# Altium project turnRacingMain.PrjPCB
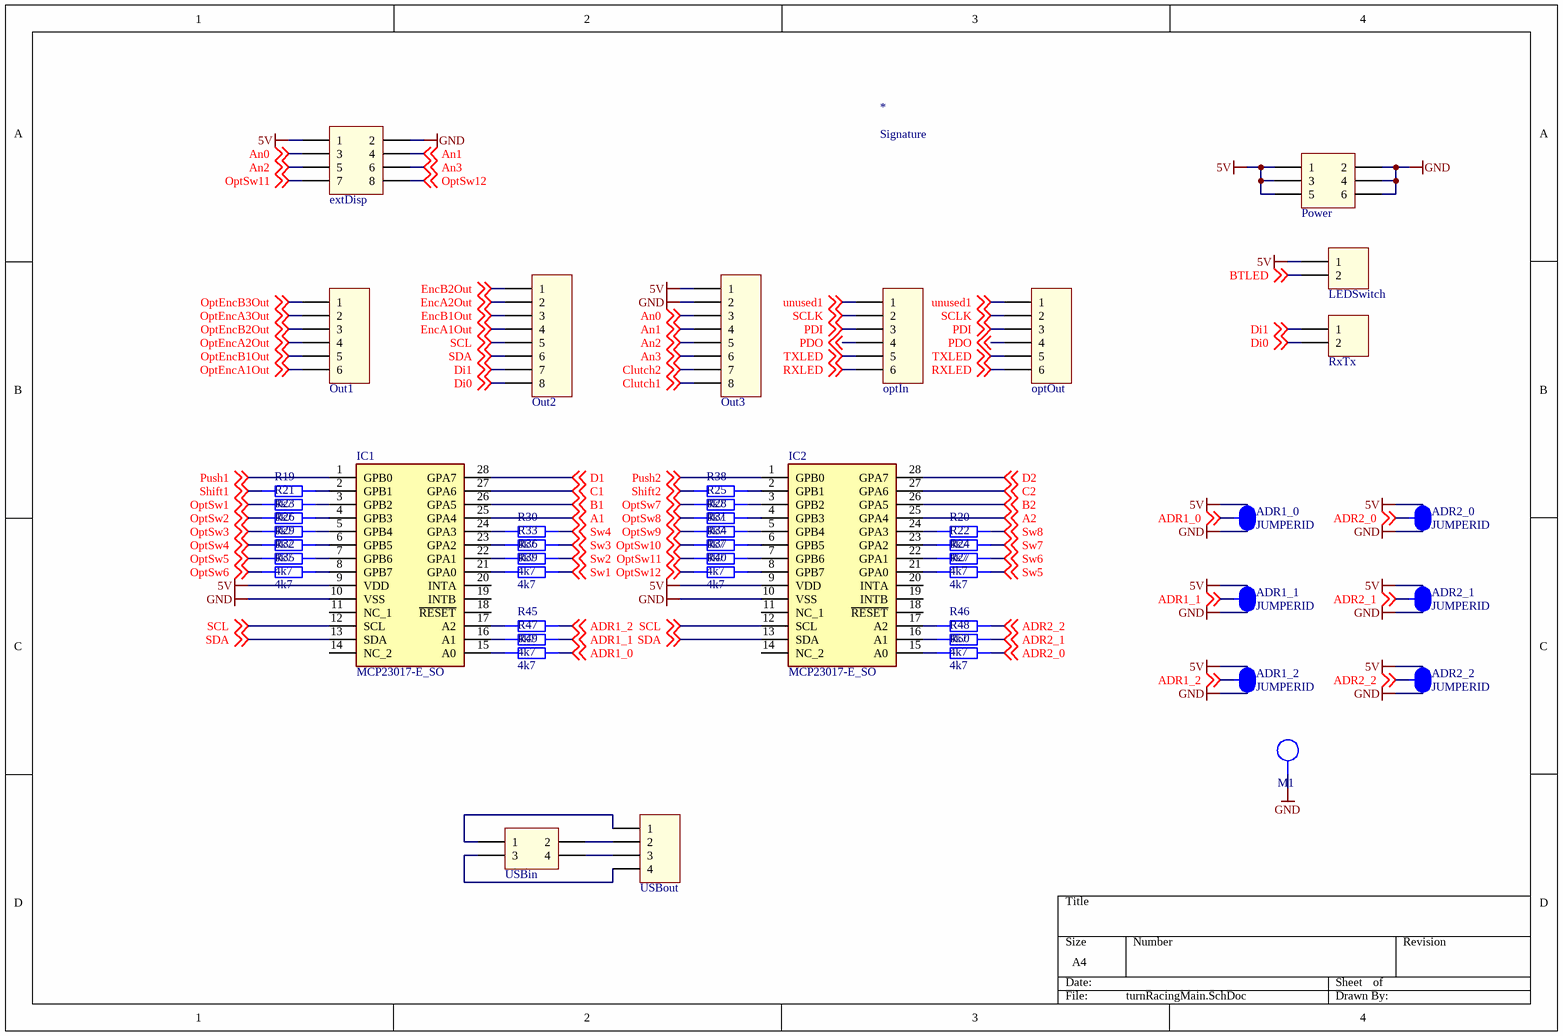
[diagram p0: turnRacingMain.SchDoc]
2 sheets, 110 parts. Net scope: global (net labels, ports and power ports of the same name join across sheets).
Board file: turnRacingMain.PcbDoc
Sheets:
  turnRacingMain.SchDoc
  turnRacingMainInput.SchDoc

## Sheet turnRacingMain.SchDoc
size A4; Rules: TODO

### Parts
*  Signature  [Signature]
ADR1_0  JUMPERID  [SMD-JUMPER-3]  (net tie, no BOM)
ADR1_1  JUMPERID  [SMD-JUMPER-3]  (net tie, no BOM)
ADR1_2  JUMPERID  [SMD-JUMPER-3]  (net tie, no BOM)
ADR2_0  JUMPERID  [SMD-JUMPER-3]  (net tie, no BOM)
ADR2_1  JUMPERID  [SMD-JUMPER-3]  (net tie, no BOM)
ADR2_2  JUMPERID  [SMD-JUMPER-3]  (net tie, no BOM)
extDisp  61300821121  [61300821121]  (value not drawn)
IC1  MCP23017-E_SO  [SOIC127P1030X265-28N]
IC2  MCP23017-E_SO  [SOIC127P1030X265-28N]
LEDSwitch  61300211121  [61300211121]  (value not drawn)
M1  mounting pad  [MOUNTING_PAD_M3]  (value not drawn)  (no BOM)
optIn  61300611121  [61300611121]  (value not drawn)
optOut  61300611121  [61300611121]  (value not drawn)
Out1  61300611121  [61300611121]  (value not drawn)
Out2  61300811121  [61300811121]  (value not drawn)
Out3  61300811121  [61300811121]  (value not drawn)
Power  61300621121  [61300621121]  (value not drawn)
R19  value 4k7  [STACKPOLE CSR0603]  (hidden comment: SMD Resistor)
R20  value 4k7  [STACKPOLE CSR0603]  (hidden comment: SMD Resistor)
R21  value 4k7  [STACKPOLE CSR0603]  (hidden comment: SMD Resistor)
R22  value 4k7  [STACKPOLE CSR0603]  (hidden comment: SMD Resistor)
R23  value 4k7  [STACKPOLE CSR0603]  (hidden comment: SMD Resistor)
R24  value 4k7  [STACKPOLE CSR0603]  (hidden comment: SMD Resistor)
R25  value 4k7  [STACKPOLE CSR0603]  (hidden comment: SMD Resistor)
R26  value 4k7  [STACKPOLE CSR0603]  (hidden comment: SMD Resistor)
R27  value 4k7  [STACKPOLE CSR0603]  (hidden comment: SMD Resistor)
R28  value 4k7  [STACKPOLE CSR0603]  (hidden comment: SMD Resistor)
R29  value 4k7  [STACKPOLE CSR0603]  (hidden comment: SMD Resistor)
R30  value 4k7  [STACKPOLE CSR0603]  (hidden comment: SMD Resistor)
R31  value 4k7  [STACKPOLE CSR0603]  (hidden comment: SMD Resistor)
R32  value 4k7  [STACKPOLE CSR0603]  (hidden comment: SMD Resistor)
R33  value 4k7  [STACKPOLE CSR0603]  (hidden comment: SMD Resistor)
R34  value 4k7  [STACKPOLE CSR0603]  (hidden comment: SMD Resistor)
R35  value 4k7  [STACKPOLE CSR0603]  (hidden comment: SMD Resistor)
R36  value 4k7  [STACKPOLE CSR0603]  (hidden comment: SMD Resistor)
R37  value 4k7  [STACKPOLE CSR0603]  (hidden comment: SMD Resistor)
R38  value 4k7  [STACKPOLE CSR0603]  (hidden comment: SMD Resistor)
R39  value 4k7  [STACKPOLE CSR0603]  (hidden comment: SMD Resistor)
R40  value 4k7  [STACKPOLE CSR0603]  (hidden comment: SMD Resistor)
R45  value 4k7  [STACKPOLE CSR0603]  (hidden comment: SMD Resistor)
R46  value 4k7  [STACKPOLE CSR0603]  (hidden comment: SMD Resistor)
R47  value 4k7  [STACKPOLE CSR0603]  (hidden comment: SMD Resistor)
R48  value 4k7  [STACKPOLE CSR0603]  (hidden comment: SMD Resistor)
R49  value 4k7  [STACKPOLE CSR0603]  (hidden comment: SMD Resistor)
R50  value 4k7  [STACKPOLE CSR0603]  (hidden comment: SMD Resistor)
RxTx  61300211121  [61300211121]  (value not drawn)
USBin  61300421121  [61300421121]  (value not drawn)
USBout  61300411121  [61300411121]  (value not drawn)

### Nets
5V: ADR1_0.3 ADR1_1.3 ADR1_2.3 ADR2_0.3 ADR2_1.3 ADR2_2.3 extDisp.1 IC1.9(VDD) IC2.9(VDD) LEDSwitch.1 Out3.1 Power.1 Power.3 Power.5
GND: ADR1_0.1 ADR1_1.1 ADR1_2.1 ADR2_0.1 ADR2_1.1 ADR2_2.1 extDisp.2 IC1.10(VSS) IC2.10(VSS) M1.1 Out3.2 Power.2 Power.4 Power.6
A1: IC1.25(GPA4) ; off-sheet A1
A2: IC2.25(GPA4) ; off-sheet A2
ADR1_0: ADR1_0.2 R49.1 ; off-sheet ADR1_0
ADR1_1: ADR1_1.2 R47.1 ; off-sheet ADR1_1
ADR1_2: ADR1_2.2 R45.1 ; off-sheet ADR1_2
ADR2_0: ADR2_0.2 R50.1 ; off-sheet ADR2_0
ADR2_1: ADR2_1.2 R48.1 ; off-sheet ADR2_1
ADR2_2: ADR2_2.2 R46.1 ; off-sheet ADR2_2
An0: extDisp.3 Out3.3 ; off-sheet An0
An1: extDisp.4 Out3.4 ; off-sheet An1
An2: extDisp.5 Out3.5 ; off-sheet An2
An3: extDisp.6 Out3.6 ; off-sheet An3
B1: IC1.26(GPA5) ; off-sheet B1
B2: IC2.26(GPA5) ; off-sheet B2
BTLED: LEDSwitch.2 ; off-sheet BTLED
C1: IC1.27(GPA6) ; off-sheet C1
C2: IC2.27(GPA6) ; off-sheet C2
Clutch1: Out3.8 ; off-sheet Clutch1
Clutch2: Out3.7 ; off-sheet Clutch2
D1: IC1.28(GPA7) ; off-sheet D1
D2: IC2.28(GPA7) ; off-sheet D2
Di0: Out2.8 RxTx.2 ; off-sheet Di0
Di1: Out2.7 RxTx.1 ; off-sheet Di1
EncA1Out: Out2.4 ; off-sheet EncA1Out  [project net EncA1]
EncA2Out: Out2.2 ; off-sheet EncA2Out  [project net EncA2]
EncB1Out: Out2.3 ; off-sheet EncB1Out  [project net EncB1]
EncB2Out: Out2.1 ; off-sheet EncB2Out  [project net EncB2]
OptEncA1Out: Out1.6 ; off-sheet OptEncA1Out  [project net OptEncA1]
OptEncA2Out: Out1.4 ; off-sheet OptEncA2Out  [project net OptEncA2]
OptEncA3Out: Out1.2 ; off-sheet OptEncA3Out  [project net OptEncA3]
OptEncB1Out: Out1.5 ; off-sheet OptEncB1Out  [project net OptEncB1]
OptEncB2Out: Out1.3 ; off-sheet OptEncB2Out  [project net OptEncB2]
OptEncB3Out: Out1.1 ; off-sheet OptEncB3Out  [project net OptEncB3]
OptSw1: R21.2 ; off-sheet OptSw1
OptSw2: R23.2 ; off-sheet OptSw2
OptSw3: R26.2 ; off-sheet OptSw3
OptSw4: R29.2 ; off-sheet OptSw4
OptSw5: R32.2 ; off-sheet OptSw5
OptSw6: R35.2 ; off-sheet OptSw6
OptSw7: R25.2 ; off-sheet OptSw7
OptSw8: R28.2 ; off-sheet OptSw8
OptSw9: R31.2 ; off-sheet OptSw9
OptSw10: R34.2 ; off-sheet OptSw10
OptSw11: extDisp.7 R37.2 ; off-sheet OptSw11
OptSw12: extDisp.8 R40.2 ; off-sheet OptSw12
PDI: optIn.3 optOut.3 ; off-sheet PDI
PDO: optIn.4 optOut.4 ; off-sheet PDO
Push1: IC1.1(GPB0) ; off-sheet Push1
Push2: IC2.1(GPB0) ; off-sheet Push2
RXLED: optIn.6 optOut.6 ; off-sheet RXLED
SCL: IC1.12(SCL) IC2.12(SCL) Out2.5 ; off-sheet SCL
SCLK: optIn.2 optOut.2 ; off-sheet SCLK
SDA: IC1.13(SDA) IC2.13(SDA) Out2.6 ; off-sheet SDA
Shift1: R19.2 ; off-sheet Shift1
Shift2: R38.2 ; off-sheet Shift2
Sw1: R39.1 ; off-sheet Sw1
Sw2: R36.1 ; off-sheet Sw2
Sw3: R33.1 ; off-sheet Sw3
Sw4: R30.1 ; off-sheet Sw4
Sw5: R27.1 ; off-sheet Sw5
Sw6: R24.1 ; off-sheet Sw6
Sw7: R22.1 ; off-sheet Sw7
Sw8: R20.1 ; off-sheet Sw8
TXLED: optIn.5 optOut.5 ; off-sheet TXLED
unused1: optIn.1 optOut.1 ; off-sheet unused1
NetIC1_2: IC1.2(GPB1) R19.1
NetIC1_3: IC1.3(GPB2) R21.1
NetIC1_4: IC1.4(GPB3) R23.1
NetIC1_5: IC1.5(GPB4) R26.1
NetIC1_6: IC1.6(GPB5) R29.1
NetIC1_7: IC1.7(GPB6) R32.1
NetIC1_8: IC1.8(GPB7) R35.1
NetIC1_15: IC1.15(A0) R49.2
NetIC1_16: IC1.16(A1) R47.2
NetIC1_17: IC1.17(A2) R45.2
NetIC1_21: IC1.21(GPA0) R39.2
NetIC1_22: IC1.22(GPA1) R36.2
NetIC1_23: IC1.23(GPA2) R33.2
NetIC1_24: IC1.24(GPA3) R30.2
NetIC2_2: IC2.2(GPB1) R38.1
NetIC2_3: IC2.3(GPB2) R25.1
NetIC2_4: IC2.4(GPB3) R28.1
NetIC2_5: IC2.5(GPB4) R31.1
NetIC2_6: IC2.6(GPB5) R34.1
NetIC2_7: IC2.7(GPB6) R37.1
NetIC2_8: IC2.8(GPB7) R40.1
NetIC2_15: IC2.15(A0) R50.2
NetIC2_16: IC2.16(A1) R48.2
NetIC2_17: IC2.17(A2) R46.2
NetIC2_21: IC2.21(GPA0) R27.2
NetIC2_22: IC2.22(GPA1) R24.2
NetIC2_23: IC2.23(GPA2) R22.2
NetIC2_24: IC2.24(GPA3) R20.2
NetUSBin_1: USBin.1 USBout.1
NetUSBin_2: USBin.2 USBout.2
NetUSBin_3: USBin.3 USBout.4
NetUSBin_4: USBin.4 USBout.3

Not connected (* = marked no-connect by the designer): IC1 11(NC_1) 14(NC_2) 18(~{RESET}) 19(INTB) 20(INTA); IC2 11(NC_1) 14(NC_2) 18(~{RESET}) 19(INTB) 20(INTA)

### Notes on the sheet
- Title:
- Projekt:
- Revision:
- Author:
- Rules:
- Checked by:
- Sheet
- of
- Size:
- A4
- Date:
- Time:

### Library data of the parts
ADR1_0-ADR1_2 ADR2_0-ADR2_2 = SMD Jumper 3
extDisp = 61300821121: WR-PHD 2.54 mm THT Dual Pin Header, 8p; Pin Number: 8; Rated Current: 3 A; Working Voltage: 250 VAC; Withstanding Voltage: 500 VAC; Pitch: 2.54 mm; ComponentLink1Description: Manufacturer; ComponentLink1URL: http://www.we-online.de; ComponentLink2Description: Datasheet; ComponentLink2URL: http://katalog.we-online.de/em/datasheet/6130xx21121.pdf; Part Number: 61300821121; Published Date: Aug 2017; Publisher: Wurth Elektronik
IC1 IC2 = MCP23017-E_SO: Integrated Circuit; Manufacturer_Name: Microchip; Manufacturer_Part_Number: MCP23017-E/SO; Height: 2.65mm
LEDSwitch RxTx = 61300211121: WR-PHD 2.54 mm THT Pin Header, 2p; Pin Number: 2; Rated Current: 3 A; Working Voltage: 250 VAC; Withstanding Voltage: 500 VAC; Pitch: 2.54 mm; ComponentLink1Description: Manufacturer; ComponentLink1URL: http://www.we-online.de; ComponentLink2Description: Datasheet; ComponentLink2URL: http://katalog.we-online.de/em/datasheet/6130xx11121.pdf; Part Number: 61300211121; Published Date: Aug 2017; Publisher: Wurth Elektronik
optIn optOut Out1 = 61300611121: WR-PHD 2.54 mm THT Pin Header, 6p; Pin Number: 6; Rated Current: 3 A; Working Voltage: 250 VAC; Withstanding Voltage: 500 VAC; Pitch: 2.54 mm; ComponentLink1Description: Manufacturer; ComponentLink1URL: http://www.we-online.de; ComponentLink2Description: Datasheet; ComponentLink2URL: http://katalog.we-online.de/em/datasheet/6130xx11121.pdf; Part Number: 61300611121; Published Date: Aug 2017; Publisher: Wurth Elektronik
Out2 Out3 = 61300811121: WR-PHD 2.54 mm THT Pin Header, 8p; Pin Number: 8; Rated Current: 3 A; Working Voltage: 250 VAC; Withstanding Voltage: 500 VAC; Pitch: 2.54 mm; ComponentLink1Description: Manufacturer; ComponentLink1URL: http://www.we-online.de; ComponentLink2Description: Datasheet; ComponentLink2URL: http://katalog.we-online.de/em/datasheet/6130xx11121.pdf; Part Number: 61300811121; Published Date: Aug 2017; Publisher: Wurth Elektronik
Power = 61300621121: WR-PHD 2.54 mm THT Dual Pin Header, 6p; Pin Number: 6; Rated Current: 3 A; Working Voltage: 250 VAC; Withstanding Voltage: 500 VAC; Pitch: 2.54 mm; ComponentLink1Description: Manufacturer; ComponentLink1URL: http://www.we-online.de; ComponentLink2Description: Datasheet; ComponentLink2URL: http://katalog.we-online.de/em/datasheet/6130xx21121.pdf; Part Number: 61300621121; Published Date: Aug 2017; Publisher: Wurth Elektronik
R19-R40 R45-R50 = SMD Resistor: Resistor with multiple footprints
USBin = 61300421121: WR-PHD 2.54 mm THT Dual Pin Header, 4p; Pin Number: 4; Rated Current: 3 A; Working Voltage: 250 VAC; Withstanding Voltage: 500 VAC; Pitch: 2.54 mm; ComponentLink1Description: Manufacturer; ComponentLink1URL: http://www.we-online.de; ComponentLink2Description: Datasheet; ComponentLink2URL: http://katalog.we-online.de/em/datasheet/6130xx21121.pdf; Part Number: 61300421121; Published Date: Aug 2017; Publisher: Wurth Elektronik
USBout = 61300411121: WR-PHD 2.54 mm THT Pin Header, 4p; Pin Number: 4; Rated Current: 3 A; Working Voltage: 250 VAC; Withstanding Voltage: 500 VAC; Pitch: 2.54 mm; ComponentLink1Description: Manufacturer; ComponentLink1URL: http://www.we-online.de; ComponentLink2Description: Datasheet; ComponentLink2URL: http://katalog.we-online.de/em/datasheet/6130xx11121.pdf; Part Number: 61300411121; Published Date: Aug 2017; Publisher: Wurth Elektronik

## Sheet turnRacingMainInput.SchDoc
size A4
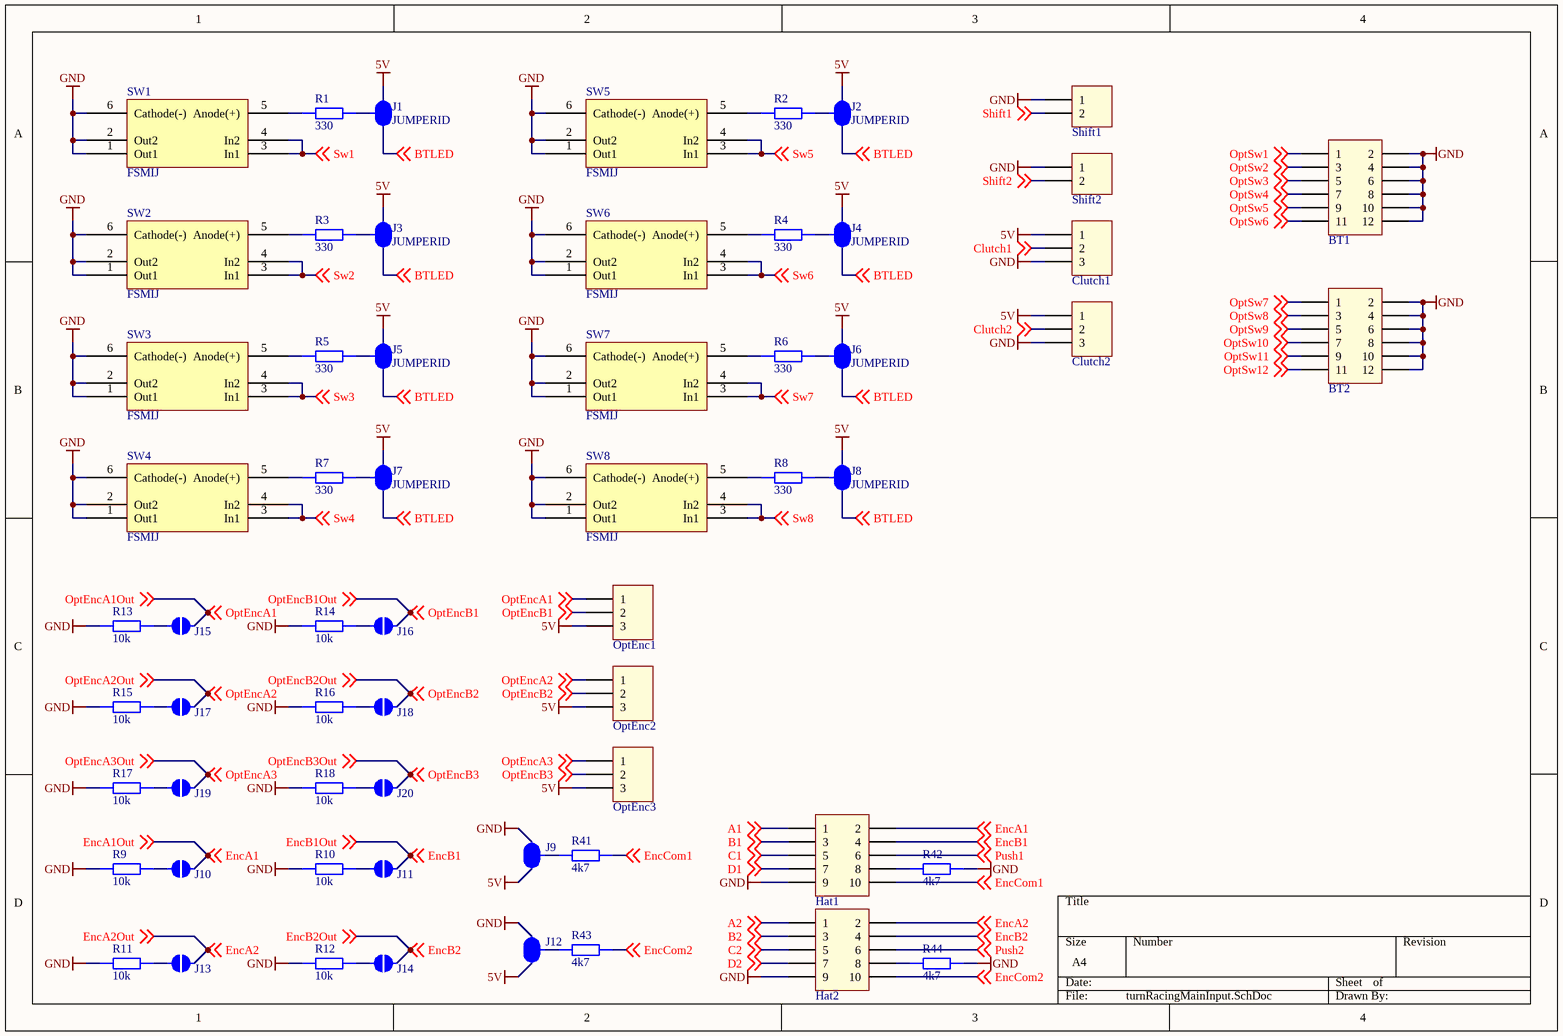
[diagram p1: turnRacingMainInput.SchDoc]

### Parts
BT1  61301221121  [61301221121]  (value not drawn)
BT2  61301221121  [61301221121]  (value not drawn)
Clutch1  61300311121  [61300311121]  (value not drawn)
Clutch2  61300311121  [61300311121]  (value not drawn)
Hat1  61301021121  [61301021121]  (value not drawn)
Hat2  61301021121  [61301021121]  (value not drawn)
J1  JUMPERID  [SMD-JUMPER-3]  (net tie, no BOM)
J2  JUMPERID  [SMD-JUMPER-3]  (net tie, no BOM)
J3  JUMPERID  [SMD-JUMPER-3]  (net tie, no BOM)
J4  JUMPERID  [SMD-JUMPER-3]  (net tie, no BOM)
J5  JUMPERID  [SMD-JUMPER-3]  (net tie, no BOM)
J6  JUMPERID  [SMD-JUMPER-3]  (net tie, no BOM)
J7  JUMPERID  [SMD-JUMPER-3]  (net tie, no BOM)
J8  JUMPERID  [SMD-JUMPER-3]  (net tie, no BOM)
J9  JUMPERID  [SMD-JUMPER-3]  (value not drawn)  (net tie, no BOM)
J10  SMD Jumper open  [SMD-JUMPER-OPEN]  (value not drawn)  (no BOM)
J11  SMD Jumper open  [SMD-JUMPER-OPEN]  (value not drawn)  (no BOM)
J12  JUMPERID  [SMD-JUMPER-3]  (value not drawn)  (net tie, no BOM)
J13  SMD Jumper open  [SMD-JUMPER-OPEN]  (value not drawn)  (no BOM)
J14  SMD Jumper open  [SMD-JUMPER-OPEN]  (value not drawn)  (no BOM)
J15  SMD Jumper open  [SMD-JUMPER-OPEN]  (value not drawn)  (no BOM)
J16  SMD Jumper open  [SMD-JUMPER-OPEN]  (value not drawn)  (no BOM)
J17  SMD Jumper open  [SMD-JUMPER-OPEN]  (value not drawn)  (no BOM)
J18  SMD Jumper open  [SMD-JUMPER-OPEN]  (value not drawn)  (no BOM)
J19  SMD Jumper open  [SMD-JUMPER-OPEN]  (value not drawn)  (no BOM)
J20  SMD Jumper open  [SMD-JUMPER-OPEN]  (value not drawn)  (no BOM)
OptEnc1  61300311121  [61300311121]  (value not drawn)
OptEnc2  61300311121  [61300311121]  (value not drawn)
OptEnc3  61300311121  [61300311121]  (value not drawn)
R1  value 330  [STACKPOLE CSR0603]  (hidden comment: SMD Resistor)
R2  value 330  [STACKPOLE CSR0603]  (hidden comment: SMD Resistor)
R3  value 330  [STACKPOLE CSR0603]  (hidden comment: SMD Resistor)
R4  value 330  [STACKPOLE CSR0603]  (hidden comment: SMD Resistor)
R5  value 330  [STACKPOLE CSR0603]  (hidden comment: SMD Resistor)
R6  value 330  [STACKPOLE CSR0603]  (hidden comment: SMD Resistor)
R7  value 330  [STACKPOLE CSR0603]  (hidden comment: SMD Resistor)
R8  value 330  [STACKPOLE CSR0603]  (hidden comment: SMD Resistor)
R9  value 10k  [STACKPOLE CSR0603]  (hidden comment: SMD Resistor)
R10  value 10k  [STACKPOLE CSR0603]  (hidden comment: SMD Resistor)
R11  value 10k  [STACKPOLE CSR0603]  (hidden comment: SMD Resistor)
R12  value 10k  [STACKPOLE CSR0603]  (hidden comment: SMD Resistor)
R13  value 10k  [STACKPOLE CSR0603]  (hidden comment: SMD Resistor)
R14  value 10k  [STACKPOLE CSR0603]  (hidden comment: SMD Resistor)
R15  value 10k  [STACKPOLE CSR0603]  (hidden comment: SMD Resistor)
R16  value 10k  [STACKPOLE CSR0603]  (hidden comment: SMD Resistor)
R17  value 10k  [STACKPOLE CSR0603]  (hidden comment: SMD Resistor)
R18  value 10k  [STACKPOLE CSR0603]  (hidden comment: SMD Resistor)
R41  value 4k7  [STACKPOLE CSR0603]  (hidden comment: SMD Resistor)
R42  value 4k7  [STACKPOLE CSR0603]  (hidden comment: SMD Resistor)
R43  value 4k7  [STACKPOLE CSR0603]  (hidden comment: SMD Resistor)
R44  value 4k7  [STACKPOLE CSR0603]  (hidden comment: SMD Resistor)
Shift1  61300211121  [61300211121]  (value not drawn)
Shift2  61300211121  [61300211121]  (value not drawn)
SW1  FSMIJ  [FSMIJ]
SW2  FSMIJ  [FSMIJ]
SW3  FSMIJ  [FSMIJ]
SW4  FSMIJ  [FSMIJ]
SW5  FSMIJ  [FSMIJ]
SW6  FSMIJ  [FSMIJ]
SW7  FSMIJ  [FSMIJ]
SW8  FSMIJ  [FSMIJ]

### Nets
5V: Clutch1.1 Clutch2.1 J1.3 J2.3 J3.3 J4.3 J5.3 J6.3 J7.3 J8.3 J9.3 J12.3 OptEnc1.3 OptEnc2.3 OptEnc3.3
GND: BT1.2 BT1.4 BT1.6 BT1.8 BT1.10 BT1.12 BT2.2 BT2.4 BT2.6 BT2.8 BT2.10 BT2.12 Clutch1.3 Clutch2.3 Hat1.9 Hat2.9 J9.1 J12.1 R9.2 R10.2 R11.2 R12.2 R13.2 R14.2 R15.2 R16.2 R17.2 R18.2 R42.1 R44.1 Shift1.1 Shift2.1 SW1.1(Out1) SW1.2(Out2) SW1.6(Cathode(-)) SW2.1(Out1) SW2.2(Out2) SW2.6(Cathode(-)) SW3.1(Out1) SW3.2(Out2) SW3.6(Cathode(-)) SW4.1(Out1) SW4.2(Out2) SW4.6(Cathode(-)) SW5.1(Out1) SW5.2(Out2) SW5.6(Cathode(-)) SW6.1(Out1) SW6.2(Out2) SW6.6(Cathode(-)) SW7.1(Out1) SW7.2(Out2) SW7.6(Cathode(-)) SW8.1(Out1) SW8.2(Out2) SW8.6(Cathode(-))
A1: Hat1.1 ; off-sheet A1
A2: Hat2.1 ; off-sheet A2
B1: Hat1.3 ; off-sheet B1
B2: Hat2.3 ; off-sheet B2
BTLED: J1.1 J2.1 J3.1 J4.1 J5.1 J6.1 J7.1 J8.1 ; off-sheet BTLED
C1: Hat1.5 ; off-sheet C1
C2: Hat2.5 ; off-sheet C2
Clutch1: Clutch1.2 ; off-sheet Clutch1
Clutch2: Clutch2.2 ; off-sheet Clutch2
D1: Hat1.7 ; off-sheet D1
D2: Hat2.7 ; off-sheet D2
EncA1: Hat1.2 J10.1 ; off-sheet EncA1, off-sheet EncA1Out  [also labelled EncA1Out]
EncA2: Hat2.2 J13.1 ; off-sheet EncA2, off-sheet EncA2Out  [also labelled EncA2Out]
EncB1: Hat1.4 J11.1 ; off-sheet EncB1, off-sheet EncB1Out  [also labelled EncB1Out]
EncB2: Hat2.4 J14.1 ; off-sheet EncB2, off-sheet EncB2Out  [also labelled EncB2Out]
EncCom1: Hat1.10 R41.1 ; off-sheet EncCom1
EncCom2: Hat2.10 R43.1 ; off-sheet EncCom2
OptEncA1: J15.1 OptEnc1.1 ; off-sheet OptEncA1Out, off-sheet OptEncA1  [also labelled OptEncA1Out]
OptEncA2: J17.1 OptEnc2.1 ; off-sheet OptEncA2Out, off-sheet OptEncA2  [also labelled OptEncA2Out]
OptEncA3: J19.1 OptEnc3.1 ; off-sheet OptEncA3Out, off-sheet OptEncA3  [also labelled OptEncA3Out]
OptEncB1: J16.1 OptEnc1.2 ; off-sheet OptEncB1Out, off-sheet OptEncB1  [also labelled OptEncB1Out]
OptEncB2: J18.1 OptEnc2.2 ; off-sheet OptEncB2Out, off-sheet OptEncB2  [also labelled OptEncB2Out]
OptEncB3: J20.1 OptEnc3.2 ; off-sheet OptEncB3Out, off-sheet OptEncB3  [also labelled OptEncB3Out]
OptSw1: BT1.1 ; off-sheet OptSw1
OptSw2: BT1.3 ; off-sheet OptSw2
OptSw3: BT1.5 ; off-sheet OptSw3
OptSw4: BT1.7 ; off-sheet OptSw4
OptSw5: BT1.9 ; off-sheet OptSw5
OptSw6: BT1.11 ; off-sheet OptSw6
OptSw7: BT2.1 ; off-sheet OptSw7
OptSw8: BT2.3 ; off-sheet OptSw8
OptSw9: BT2.5 ; off-sheet OptSw9
OptSw10: BT2.7 ; off-sheet OptSw10
OptSw11: BT2.9 ; off-sheet OptSw11
OptSw12: BT2.11 ; off-sheet OptSw12
Push1: Hat1.6 ; off-sheet Push1
Push2: Hat2.6 ; off-sheet Push2
Shift1: Shift1.2 ; off-sheet Shift1
Shift2: Shift2.2 ; off-sheet Shift2
Sw1: SW1.3(In1) SW1.4(In2) ; off-sheet Sw1
Sw2: SW2.3(In1) SW2.4(In2) ; off-sheet Sw2
Sw3: SW3.3(In1) SW3.4(In2) ; off-sheet Sw3
Sw4: SW4.3(In1) SW4.4(In2) ; off-sheet Sw4
Sw5: SW5.3(In1) SW5.4(In2) ; off-sheet Sw5
Sw6: SW6.3(In1) SW6.4(In2) ; off-sheet Sw6
Sw7: SW7.3(In1) SW7.4(In2) ; off-sheet Sw7
Sw8: SW8.3(In1) SW8.4(In2) ; off-sheet Sw8
NetHat1_8: Hat1.8 R42.2
NetHat2_8: Hat2.8 R44.2
NetJ1_2: J1.2 R1.1
NetJ2_2: J2.2 R2.1
NetJ3_2: J3.2 R3.1
NetJ4_2: J4.2 R4.1
NetJ5_2: J5.2 R5.1
NetJ6_2: J6.2 R6.1
NetJ7_2: J7.2 R7.1
NetJ8_2: J8.2 R8.1
NetJ9_2: J9.2 R41.2
NetJ10_2: J10.2 R9.1
NetJ11_2: J11.2 R10.1
NetJ12_2: J12.2 R43.2
NetJ13_2: J13.2 R11.1
NetJ14_2: J14.2 R12.1
NetJ15_2: J15.2 R13.1
NetJ16_2: J16.2 R14.1
NetJ17_2: J17.2 R15.1
NetJ18_2: J18.2 R16.1
NetJ19_2: J19.2 R17.1
NetJ20_2: J20.2 R18.1
NetR1_2: R1.2 SW1.5(Anode(+))
NetR2_2: R2.2 SW5.5(Anode(+))
NetR3_2: R3.2 SW2.5(Anode(+))
NetR4_2: R4.2 SW6.5(Anode(+))
NetR5_2: R5.2 SW3.5(Anode(+))
NetR6_2: R6.2 SW7.5(Anode(+))
NetR7_2: R7.2 SW4.5(Anode(+))
NetR8_2: R8.2 SW8.5(Anode(+))

### Library data of the parts
BT1 BT2 = 61301221121: WR-PHD 2.54 mm THT Dual Pin Header, 12p; Pin Number: 12; Rated Current: 3 A; Working Voltage: 250 VAC; Withstanding Voltage: 500 VAC; Pitch: 2.54 mm; ComponentLink1Description: Manufacturer; ComponentLink1URL: http://www.we-online.de; ComponentLink2Description: Datasheet; ComponentLink2URL: http://katalog.we-online.de/em/datasheet/6130xx21121.pdf; Part Number: 61301221121; Published Date: Aug 2017; Publisher: Wurth Elektronik
Clutch1 Clutch2 OptEnc1-OptEnc3 = 61300311121: WR-PHD 2.54 mm THT Pin Header, 3p; Pin Number: 3; Rated Current: 3 A; Working Voltage: 250 VAC; Withstanding Voltage: 500 VAC; Pitch: 2.54 mm; ComponentLink1Description: Manufacturer; ComponentLink1URL: http://www.we-online.de; ComponentLink2Description: Datasheet; ComponentLink2URL: http://katalog.we-online.de/em/datasheet/6130xx11121.pdf; Part Number: 61300311121; Published Date: Aug 2017; Publisher: Wurth Elektronik
Hat1 Hat2 = 61301021121: WR-PHD 2.54 mm THT Dual Pin Header, 10p; Pin Number: 10; Rated Current: 3 A; Working Voltage: 250 VAC; Withstanding Voltage: 500 VAC; Pitch: 2.54 mm; ComponentLink1Description: Manufacturer; ComponentLink1URL: http://www.we-online.de; ComponentLink2Description: Datasheet; ComponentLink2URL: http://katalog.we-online.de/em/datasheet/6130xx21121.pdf; Part Number: 61301021121; Published Date: Aug 2017; Publisher: Wurth Elektronik
J1-J9 J12 = SMD Jumper 3
R1-R18 R41-R44 = SMD Resistor: Resistor with multiple footprints
Shift1 Shift2 = 61300211121: as LEDSwitch on sheet turnRacingMain; ComponentLink1Description: Manufacturer; ComponentLink1URL: http://www.we-online.de; ComponentLink2Description: Datasheet; ComponentLink2URL: http://katalog.we-online.de/em/datasheet/6130xx11121.pdf; Part Number: 61300211121; Published Date: Aug 2017; Publisher: Wurth Elektronik

## Nets that join several sheets
5V: turnRacingMain (14 pins), turnRacingMainInput (15 pins)
GND: turnRacingMain (14 pins), turnRacingMainInput (56 pins)
A1: turnRacingMain (IC1.25), turnRacingMainInput (Hat1.1)
A2: turnRacingMain (IC2.25), turnRacingMainInput (Hat2.1)
B1: turnRacingMain (IC1.26), turnRacingMainInput (Hat1.3)
B2: turnRacingMain (IC2.26), turnRacingMainInput (Hat2.3)
BTLED: turnRacingMain (LEDSwitch.2), turnRacingMainInput (8 pins)
C1: turnRacingMain (IC1.27), turnRacingMainInput (Hat1.5)
C2: turnRacingMain (IC2.27), turnRacingMainInput (Hat2.5)
Clutch1: turnRacingMain (Out3.8), turnRacingMainInput (Clutch1.2)
Clutch2: turnRacingMain (Out3.7), turnRacingMainInput (Clutch2.2)
D1: turnRacingMain (IC1.28), turnRacingMainInput (Hat1.7)
D2: turnRacingMain (IC2.28), turnRacingMainInput (Hat2.7)
EncA1: turnRacingMain (Out2.4), turnRacingMainInput (Hat1.2 J10.1)
EncA2: turnRacingMain (Out2.2), turnRacingMainInput (Hat2.2 J13.1)
EncB1: turnRacingMain (Out2.3), turnRacingMainInput (Hat1.4 J11.1)
EncB2: turnRacingMain (Out2.1), turnRacingMainInput (Hat2.4 J14.1)
OptEncA1: turnRacingMain (Out1.6), turnRacingMainInput (J15.1 OptEnc1.1)
OptEncA2: turnRacingMain (Out1.4), turnRacingMainInput (J17.1 OptEnc2.1)
OptEncA3: turnRacingMain (Out1.2), turnRacingMainInput (J19.1 OptEnc3.1)
OptEncB1: turnRacingMain (Out1.5), turnRacingMainInput (J16.1 OptEnc1.2)
OptEncB2: turnRacingMain (Out1.3), turnRacingMainInput (J18.1 OptEnc2.2)
OptEncB3: turnRacingMain (Out1.1), turnRacingMainInput (J20.1 OptEnc3.2)
OptSw1: turnRacingMain (R21.2), turnRacingMainInput (BT1.1)
OptSw2: turnRacingMain (R23.2), turnRacingMainInput (BT1.3)
OptSw3: turnRacingMain (R26.2), turnRacingMainInput (BT1.5)
OptSw4: turnRacingMain (R29.2), turnRacingMainInput (BT1.7)
OptSw5: turnRacingMain (R32.2), turnRacingMainInput (BT1.9)
OptSw6: turnRacingMain (R35.2), turnRacingMainInput (BT1.11)
OptSw7: turnRacingMain (R25.2), turnRacingMainInput (BT2.1)
OptSw8: turnRacingMain (R28.2), turnRacingMainInput (BT2.3)
OptSw9: turnRacingMain (R31.2), turnRacingMainInput (BT2.5)
OptSw10: turnRacingMain (R34.2), turnRacingMainInput (BT2.7)
OptSw11: turnRacingMain (extDisp.7 R37.2), turnRacingMainInput (BT2.9)
OptSw12: turnRacingMain (extDisp.8 R40.2), turnRacingMainInput (BT2.11)
Push1: turnRacingMain (IC1.1), turnRacingMainInput (Hat1.6)
Push2: turnRacingMain (IC2.1), turnRacingMainInput (Hat2.6)
Shift1: turnRacingMain (R19.2), turnRacingMainInput (Shift1.2)
Shift2: turnRacingMain (R38.2), turnRacingMainInput (Shift2.2)
Sw1: turnRacingMain (R39.1), turnRacingMainInput (SW1.3 SW1.4)
Sw2: turnRacingMain (R36.1), turnRacingMainInput (SW2.3 SW2.4)
Sw3: turnRacingMain (R33.1), turnRacingMainInput (SW3.3 SW3.4)
Sw4: turnRacingMain (R30.1), turnRacingMainInput (SW4.3 SW4.4)
Sw5: turnRacingMain (R27.1), turnRacingMainInput (SW5.3 SW5.4)
Sw6: turnRacingMain (R24.1), turnRacingMainInput (SW6.3 SW6.4)
Sw7: turnRacingMain (R22.1), turnRacingMainInput (SW7.3 SW7.4)
Sw8: turnRacingMain (R20.1), turnRacingMainInput (SW8.3 SW8.4)